# Altium schematic sheet LoRa.SchDoc
size A4; SheetNumber: 3; SheetTotal: 3
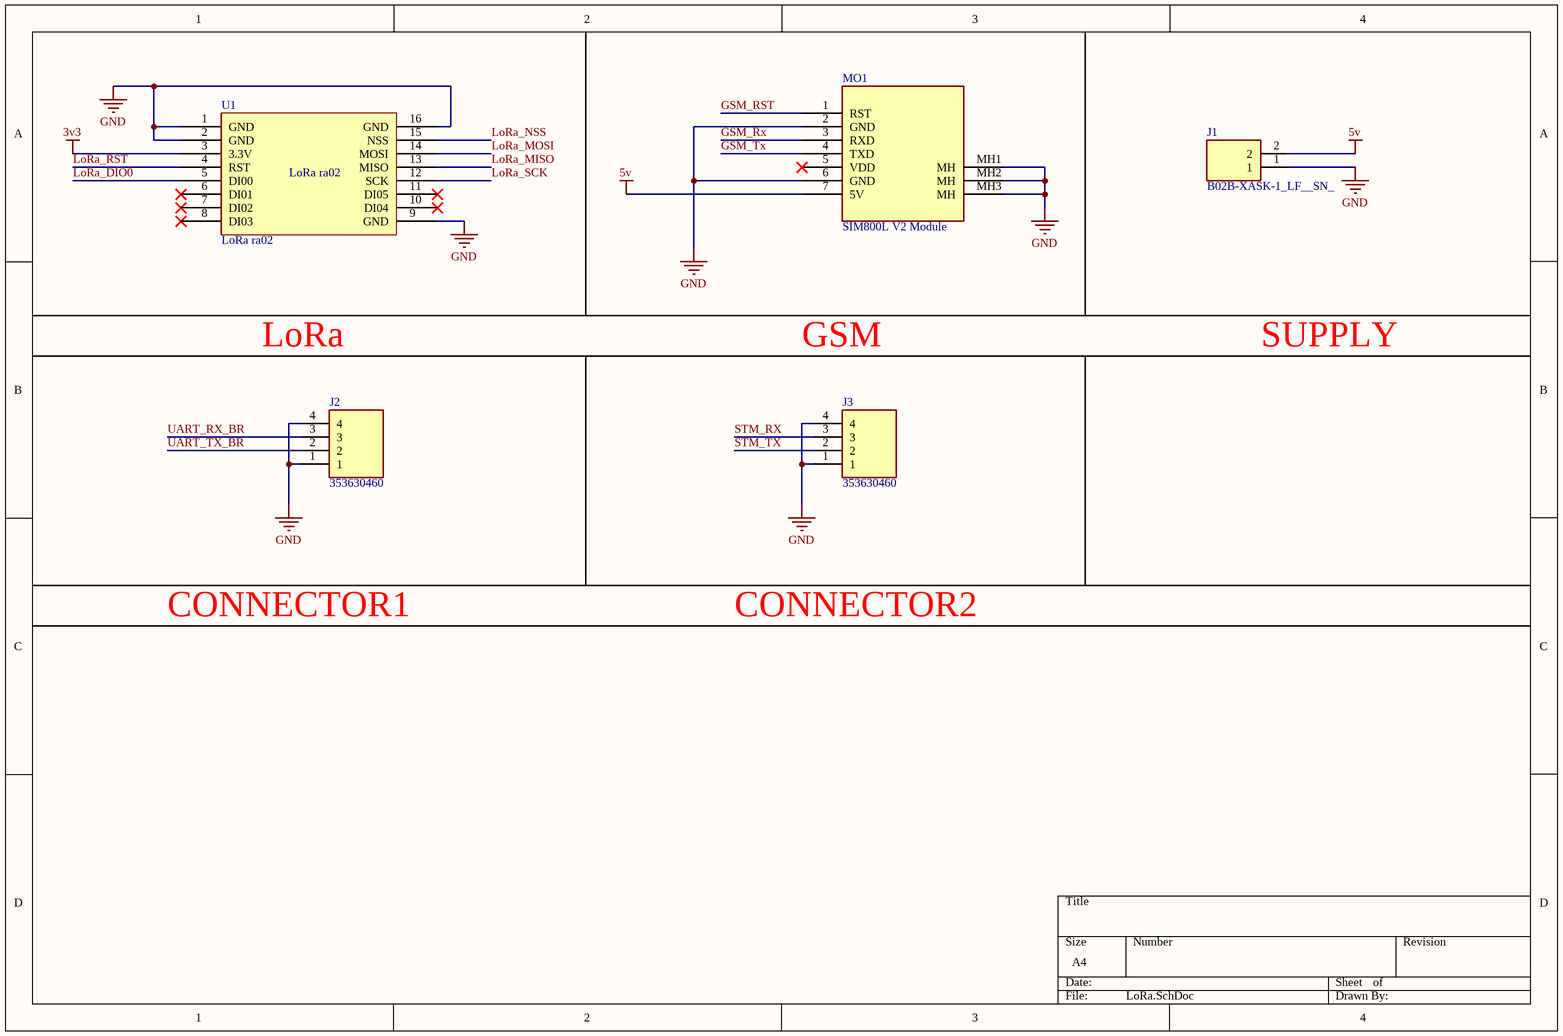
[diagram p0: LoRa.SchDoc]

## Parts
J1  B02B-XASK-1_LF__SN_  [SHDR2W60P0X250_1X2_750X640X880P]
J2  353630460  [353630460]
J3  353630460  [353630460]
MO1  SIM800L V2 Module  [SIM800LV2.0]
U1  LoRa ra02  [LoRa]

## Nets
3v3: U1.3(3.3V)
5v: J1.2 MO1.7(5V)
GND: J1.1 J2.1 J2.4 J3.1 J3.4 MO1.2(GND) MO1.6(GND) MO1.MH1(MH) MO1.MH2(MH) MO1.MH3(MH) U1.1(GND) U1.2(GND) U1.9(GND) U1.16(GND)
GSM_RST: MO1.1(RST)
GSM_Rx: MO1.3(RXD)
GSM_Tx: MO1.4(TXD)
LoRa_DIO0: U1.5(DI00)
LoRa_MISO: U1.13(MISO)
LoRa_MOSI: U1.14(MOSI)
LoRa_NSS: U1.15(NSS)
LoRa_RST: U1.4(RST)
LoRa_SCK: U1.12(SCK)
STM_RX: J3.3
STM_TX: J3.2
UART_RX_BR: J2.3
UART_TX_BR: J2.2

Not connected (* = marked no-connect by the designer): MO1 5(VDD)*; U1 6(DI01)* 7(DI02)* 8(DI03)* 10(DI04)* 11(DI05)*

## Notes on the sheet
- LoRa
- GSM
- SUPPLY
- CONNECTOR1
- CONNECTOR2

## Library data of the parts
J1 = B02B-XASK-1_LF__SN_: Connector; Manufacturer_Name: JST (JAPAN SOLDERLESS TERMINALS); Manufacturer_Part_Number: B02B-XASK-1(LF)(SN); Datasheet Link: http://www.jst-mfg.com/product/pdf/eng/eXA1.pdf; Height: 8.8mm; Mouser Part Number: N/A; Mouser Price/Stock: https://www.mouser.co.uk/ProductDetail/JST-Commercial/B02B-XASK-1LFSN?qs=IKkN%2F947nfBty2GocXf7QA%3D%3D; Arrow Part Number: B02B-XASK-1(LF)(SN); Arrow Price/Stock: https://www.arrow.com/en/products/b02b-xask-1-lf-sn/jst-manufacturing?utm_currency=USD&region=europe
J2 J3 = 353630460: Connector; Manufacturer_Name: Molex; Datasheet Link: https://www.molex.com/pdm_docs/sd/353630260_sd.pdf; Height: 5.5mm; Manufacturer_Part_Number: 353630460; Arrow Part Number: 353630460; Arrow Price/Stock: https://www.arrow.com/en/products/35363-0460/molex?region=nac
MO1 = SIM800LV2.0: GSM Module
U1 = LoRa ra02: gg